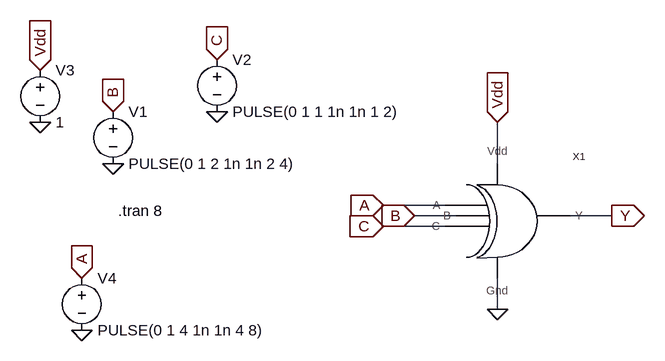
[diagram p0: schematic 3i_xor_test.asc]
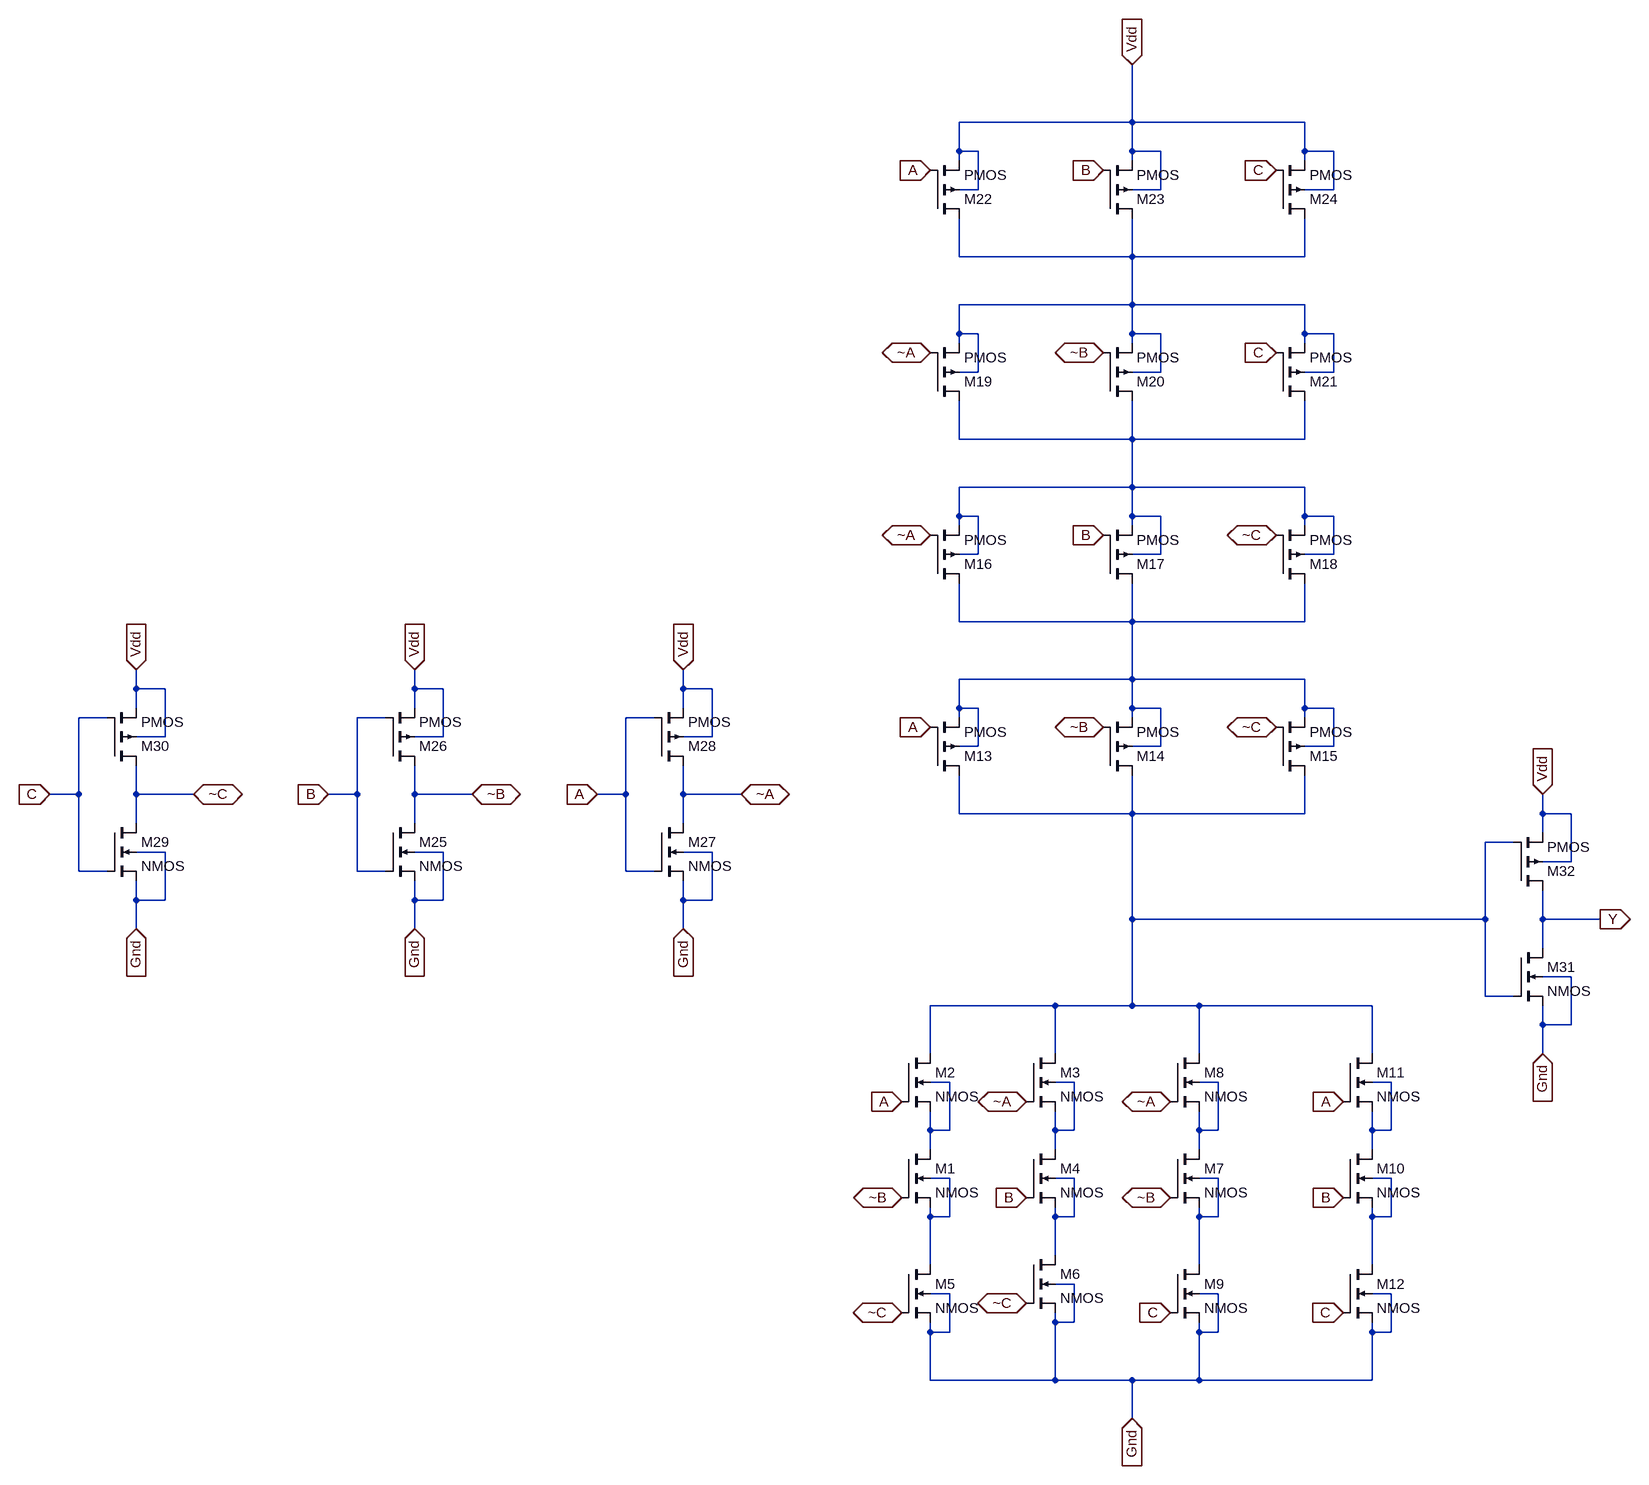
[diagram p1: sub-circuit 3i_xor.asc]
3i_xor_test.asc, the LTspice schematic file:
Version 4
SHEET 1 880 680
WIRE 288 80 288 16
WIRE 208 144 112 144
WIRE 224 160 160 160
WIRE 464 160 400 160
WIRE 208 176 112 176
WIRE 288 304 288 256
FLAG 112 144 A
IOPIN 112 144 In
FLAG 160 160 B
IOPIN 160 160 In
FLAG 112 176 C
IOPIN 112 176 In
FLAG 288 16 Vdd
IOPIN 288 16 In
FLAG 288 304 0
FLAG 464 160 Y
IOPIN 464 160 Out
FLAG -304 0 B
IOPIN -304 0 In
FLAG -144 -80 C
IOPIN -144 -80 In
FLAG -416 -64 Vdd
IOPIN -416 -64 In
FLAG -416 16 0
FLAG -304 80 0
FLAG -144 0 0
FLAG -352 256 A
IOPIN -352 256 In
FLAG -352 336 0
SYMBOL 3i_xor 304 160 R0
SYMATTR InstName X1
SYMBOL voltage -304 -16 R0
WINDOW 123 0 0 Left 0
WINDOW 39 0 0 Left 0
SYMATTR InstName V1
SYMATTR Value PULSE(0 1 2 1n 1n 2 4)
SYMBOL voltage -144 -96 R0
WINDOW 123 0 0 Left 0
WINDOW 39 0 0 Left 0
SYMATTR InstName V2
SYMATTR Value PULSE(0 1 1 1n 1n 1 2)
SYMBOL voltage -416 -80 R0
SYMATTR InstName V3
SYMATTR Value 1
SYMBOL voltage -352 240 R0
WINDOW 123 0 0 Left 0
WINDOW 39 0 0 Left 0
SYMATTR InstName V4
SYMATTR Value PULSE(0 1 4 1n 1n 4 8)
TEXT -296 152 Left 2 !.tran 8

3i_xor.asc, the sub-circuit schematic file:
Version 4
SHEET 1 1516 712
WIRE 448 -1552 448 -1648
WIRE 448 -1552 160 -1552
WIRE 736 -1552 448 -1552
WIRE 160 -1504 160 -1552
WIRE 192 -1504 160 -1504
WIRE 448 -1504 448 -1552
WIRE 496 -1504 448 -1504
WIRE 736 -1504 736 -1552
WIRE 784 -1504 736 -1504
WIRE 160 -1488 160 -1504
WIRE 448 -1488 448 -1504
WIRE 736 -1488 736 -1504
WIRE 192 -1440 192 -1504
WIRE 192 -1440 160 -1440
WIRE 496 -1440 496 -1504
WIRE 496 -1440 448 -1440
WIRE 784 -1440 784 -1504
WIRE 784 -1440 736 -1440
WIRE 160 -1328 160 -1392
WIRE 448 -1328 448 -1392
WIRE 448 -1328 160 -1328
WIRE 736 -1328 736 -1392
WIRE 736 -1328 448 -1328
WIRE 448 -1248 448 -1328
WIRE 448 -1248 160 -1248
WIRE 736 -1248 448 -1248
WIRE 160 -1200 160 -1248
WIRE 192 -1200 160 -1200
WIRE 448 -1200 448 -1248
WIRE 496 -1200 448 -1200
WIRE 736 -1200 736 -1248
WIRE 784 -1200 736 -1200
WIRE 160 -1184 160 -1200
WIRE 448 -1184 448 -1200
WIRE 736 -1184 736 -1200
WIRE 192 -1136 192 -1200
WIRE 192 -1136 160 -1136
WIRE 496 -1136 496 -1200
WIRE 496 -1136 448 -1136
WIRE 784 -1136 784 -1200
WIRE 784 -1136 736 -1136
WIRE 160 -1024 160 -1088
WIRE 448 -1024 448 -1088
WIRE 448 -1024 160 -1024
WIRE 736 -1024 736 -1088
WIRE 736 -1024 448 -1024
WIRE 448 -944 448 -1024
WIRE 448 -944 160 -944
WIRE 736 -944 448 -944
WIRE 160 -896 160 -944
WIRE 192 -896 160 -896
WIRE 448 -896 448 -944
WIRE 496 -896 448 -896
WIRE 736 -896 736 -944
WIRE 784 -896 736 -896
WIRE 160 -880 160 -896
WIRE 448 -880 448 -896
WIRE 736 -880 736 -896
WIRE 192 -832 192 -896
WIRE 192 -832 160 -832
WIRE 496 -832 496 -896
WIRE 496 -832 448 -832
WIRE 784 -832 784 -896
WIRE 784 -832 736 -832
WIRE 160 -720 160 -784
WIRE 448 -720 448 -784
WIRE 448 -720 160 -720
WIRE 736 -720 736 -784
WIRE 736 -720 448 -720
WIRE 448 -624 448 -720
WIRE 448 -624 160 -624
WIRE 736 -624 448 -624
WIRE -1760 -608 -1760 -640
WIRE -1712 -608 -1760 -608
WIRE -1296 -608 -1296 -640
WIRE -1248 -608 -1296 -608
WIRE -848 -608 -848 -640
WIRE -800 -608 -848 -608
WIRE -1760 -576 -1760 -608
WIRE -1296 -576 -1296 -608
WIRE -848 -576 -848 -608
WIRE 160 -576 160 -624
WIRE 192 -576 160 -576
WIRE 448 -576 448 -624
WIRE 496 -576 448 -576
WIRE 736 -576 736 -624
WIRE 784 -576 736 -576
WIRE -1808 -560 -1856 -560
WIRE -1344 -560 -1392 -560
WIRE -896 -560 -944 -560
WIRE 160 -560 160 -576
WIRE 448 -560 448 -576
WIRE 736 -560 736 -576
WIRE -1712 -528 -1712 -608
WIRE -1712 -528 -1760 -528
WIRE -1248 -528 -1248 -608
WIRE -1248 -528 -1296 -528
WIRE -800 -528 -800 -608
WIRE -800 -528 -848 -528
WIRE 192 -512 192 -576
WIRE 192 -512 160 -512
WIRE 496 -512 496 -576
WIRE 496 -512 448 -512
WIRE 784 -512 784 -576
WIRE 784 -512 736 -512
WIRE -1856 -432 -1856 -560
WIRE -1856 -432 -1904 -432
WIRE -1760 -432 -1760 -480
WIRE -1664 -432 -1760 -432
WIRE -1392 -432 -1392 -560
WIRE -1392 -432 -1440 -432
WIRE -1296 -432 -1296 -480
WIRE -1200 -432 -1296 -432
WIRE -944 -432 -944 -560
WIRE -944 -432 -992 -432
WIRE -848 -432 -848 -480
WIRE -752 -432 -848 -432
WIRE 160 -400 160 -464
WIRE 448 -400 448 -464
WIRE 448 -400 160 -400
WIRE 736 -400 736 -464
WIRE 736 -400 448 -400
WIRE 1184 -400 1184 -432
WIRE 1232 -400 1184 -400
WIRE -1760 -384 -1760 -432
WIRE -1296 -384 -1296 -432
WIRE -848 -384 -848 -432
WIRE 1184 -368 1184 -400
WIRE 1136 -352 1088 -352
WIRE -1712 -336 -1760 -336
WIRE -1248 -336 -1296 -336
WIRE -800 -336 -848 -336
WIRE 1232 -320 1232 -400
WIRE 1232 -320 1184 -320
WIRE -1856 -304 -1856 -432
WIRE -1808 -304 -1856 -304
WIRE -1392 -304 -1392 -432
WIRE -1344 -304 -1392 -304
WIRE -944 -304 -944 -432
WIRE -896 -304 -944 -304
WIRE -1760 -256 -1760 -288
WIRE -1712 -256 -1712 -336
WIRE -1712 -256 -1760 -256
WIRE -1296 -256 -1296 -288
WIRE -1248 -256 -1248 -336
WIRE -1248 -256 -1296 -256
WIRE -848 -256 -848 -288
WIRE -800 -256 -800 -336
WIRE -800 -256 -848 -256
WIRE 448 -224 448 -400
WIRE 1088 -224 1088 -352
WIRE 1088 -224 448 -224
WIRE 1184 -224 1184 -272
WIRE 1280 -224 1184 -224
WIRE -1760 -208 -1760 -256
WIRE -1296 -208 -1296 -256
WIRE -848 -208 -848 -256
WIRE 1184 -176 1184 -224
WIRE 1232 -128 1184 -128
WIRE 1088 -96 1088 -224
WIRE 1136 -96 1088 -96
WIRE 320 -80 112 -80
WIRE 448 -80 448 -224
WIRE 448 -80 320 -80
WIRE 560 -80 448 -80
WIRE 848 -80 560 -80
WIRE 1184 -48 1184 -80
WIRE 1232 -48 1232 -128
WIRE 1232 -48 1184 -48
WIRE 112 0 112 -80
WIRE 320 0 320 -80
WIRE 560 0 560 -80
WIRE 848 0 848 -80
WIRE 1184 0 1184 -48
WIRE 144 48 112 48
WIRE 352 48 320 48
WIRE 592 48 560 48
WIRE 880 48 848 48
WIRE 112 128 112 96
WIRE 144 128 144 48
WIRE 144 128 112 128
WIRE 320 128 320 96
WIRE 352 128 352 48
WIRE 352 128 320 128
WIRE 560 128 560 96
WIRE 592 128 592 48
WIRE 592 128 560 128
WIRE 848 128 848 96
WIRE 880 128 880 48
WIRE 880 128 848 128
WIRE 112 160 112 128
WIRE 320 160 320 128
WIRE 560 160 560 128
WIRE 848 160 848 128
WIRE 144 208 112 208
WIRE 352 208 320 208
WIRE 592 208 560 208
WIRE 880 208 848 208
WIRE 112 272 112 256
WIRE 144 272 144 208
WIRE 144 272 112 272
WIRE 320 272 320 256
WIRE 352 272 352 208
WIRE 352 272 320 272
WIRE 560 272 560 256
WIRE 592 272 592 208
WIRE 592 272 560 272
WIRE 848 272 848 256
WIRE 880 272 880 208
WIRE 880 272 848 272
WIRE 320 336 320 272
WIRE 112 352 112 272
WIRE 560 352 560 272
WIRE 848 352 848 272
WIRE 352 384 320 384
WIRE 144 400 112 400
WIRE 592 400 560 400
WIRE 880 400 848 400
WIRE 320 448 320 432
WIRE 352 448 352 384
WIRE 352 448 320 448
WIRE 112 464 112 448
WIRE 144 464 144 400
WIRE 144 464 112 464
WIRE 560 464 560 448
WIRE 592 464 592 400
WIRE 592 464 560 464
WIRE 848 464 848 448
WIRE 880 464 880 400
WIRE 880 464 848 464
WIRE 112 544 112 464
WIRE 320 544 320 448
WIRE 320 544 112 544
WIRE 448 544 320 544
WIRE 560 544 560 464
WIRE 560 544 448 544
WIRE 848 544 848 464
WIRE 848 544 560 544
WIRE 448 608 448 544
FLAG 64 80 A
IOPIN 64 80 In
FLAG 64 240 ~B
IOPIN 64 240 BiDir
FLAG 272 80 ~A
IOPIN 272 80 BiDir
FLAG 272 240 B
IOPIN 272 240 In
FLAG 64 432 ~C
IOPIN 64 432 BiDir
FLAG 272 416 ~C
IOPIN 272 416 BiDir
FLAG 512 80 ~A
IOPIN 512 80 BiDir
FLAG 512 240 ~B
IOPIN 512 240 BiDir
FLAG 512 432 C
IOPIN 512 432 In
FLAG 800 80 A
IOPIN 800 80 In
FLAG 800 240 B
IOPIN 800 240 In
FLAG 800 432 C
IOPIN 800 432 In
FLAG 112 -544 A
IOPIN 112 -544 In
FLAG 400 -544 ~B
IOPIN 400 -544 BiDir
FLAG 688 -544 ~C
IOPIN 688 -544 BiDir
FLAG 112 -864 ~A
IOPIN 112 -864 BiDir
FLAG 400 -864 B
IOPIN 400 -864 In
FLAG 688 -864 ~C
IOPIN 688 -864 BiDir
FLAG 112 -1168 ~A
IOPIN 112 -1168 BiDir
FLAG 400 -1168 ~B
IOPIN 400 -1168 BiDir
FLAG 688 -1168 C
IOPIN 688 -1168 In
FLAG 112 -1472 A
IOPIN 112 -1472 In
FLAG 400 -1472 B
IOPIN 400 -1472 In
FLAG 688 -1472 C
IOPIN 688 -1472 In
FLAG 448 -1648 Vdd
IOPIN 448 -1648 In
FLAG 448 608 Gnd
IOPIN 448 608 In
FLAG -1296 -640 Vdd
IOPIN -1296 -640 In
FLAG -1440 -432 B
IOPIN -1440 -432 In
FLAG -1200 -432 ~B
IOPIN -1200 -432 BiDir
FLAG -848 -640 Vdd
IOPIN -848 -640 In
FLAG -992 -432 A
IOPIN -992 -432 In
FLAG -752 -432 ~A
IOPIN -752 -432 BiDir
FLAG -1296 -208 Gnd
IOPIN -1296 -208 In
FLAG -848 -208 Gnd
IOPIN -848 -208 In
FLAG -1760 -640 Vdd
IOPIN -1760 -640 In
FLAG -1904 -432 C
IOPIN -1904 -432 In
FLAG -1664 -432 ~C
IOPIN -1664 -432 BiDir
FLAG -1760 -208 Gnd
IOPIN -1760 -208 In
FLAG 1184 -432 Vdd
IOPIN 1184 -432 In
FLAG 1280 -224 Y
IOPIN 1280 -224 Out
FLAG 1184 0 Gnd
IOPIN 1184 0 In
SYMBOL nmos4 64 160 R0
SYMATTR InstName M1
SYMBOL nmos4 64 0 R0
SYMATTR InstName M2
SYMBOL nmos4 272 0 R0
SYMATTR InstName M3
SYMBOL nmos4 272 160 R0
SYMATTR InstName M4
SYMBOL nmos4 64 352 R0
SYMATTR InstName M5
SYMBOL nmos4 272 336 R0
SYMATTR InstName M6
SYMBOL nmos4 512 160 R0
SYMATTR InstName M7
SYMBOL nmos4 512 0 R0
SYMATTR InstName M8
SYMBOL nmos4 512 352 R0
SYMATTR InstName M9
SYMBOL nmos4 800 160 R0
SYMATTR InstName M10
SYMBOL nmos4 800 0 R0
SYMATTR InstName M11
SYMBOL nmos4 800 352 R0
SYMATTR InstName M12
SYMBOL pmos4 112 -464 M180
SYMATTR InstName M13
SYMBOL pmos4 400 -464 M180
SYMATTR InstName M14
SYMBOL pmos4 688 -464 M180
SYMATTR InstName M15
SYMBOL pmos4 112 -784 M180
SYMATTR InstName M16
SYMBOL pmos4 400 -784 M180
SYMATTR InstName M17
SYMBOL pmos4 688 -784 M180
SYMATTR InstName M18
SYMBOL pmos4 112 -1088 M180
SYMATTR InstName M19
SYMBOL pmos4 400 -1088 M180
SYMATTR InstName M20
SYMBOL pmos4 688 -1088 M180
SYMATTR InstName M21
SYMBOL pmos4 112 -1392 M180
SYMATTR InstName M22
SYMBOL pmos4 400 -1392 M180
SYMATTR InstName M23
SYMBOL pmos4 688 -1392 M180
SYMATTR InstName M24
SYMBOL nmos4 -1344 -384 R0
SYMATTR InstName M25
SYMBOL pmos4 -1344 -480 M180
SYMATTR InstName M26
SYMBOL nmos4 -896 -384 R0
SYMATTR InstName M27
SYMBOL pmos4 -896 -480 M180
SYMATTR InstName M28
SYMBOL nmos4 -1808 -384 R0
SYMATTR InstName M29
SYMBOL pmos4 -1808 -480 M180
SYMATTR InstName M30
SYMBOL nmos4 1136 -176 R0
SYMATTR InstName M31
SYMBOL pmos4 1136 -272 M180
SYMATTR InstName M32

The netlist it stands for:
* 3i_xor_test.asc
XX1 A B C Vdd 0 Y 3i_xor
V1 B 0 PULSE(0 1 2 1n 1n 2 4)
V2 C 0 PULSE(0 1 1 1n 1n 1 2)
V3 Vdd 0 1
V4 A 0 PULSE(0 1 4 1n 1n 4 8)

* block symbol definitions
.subckt 3i_xor A B C Vdd Gnd Y
M1 N005 ~B N009 N009 NMOS
M2 N004 A N005 N005 NMOS
M3 N004 ~A N006 N006 NMOS
M4 N006 B N010 N010 NMOS
M5 N009 ~C Gnd Gnd NMOS
M6 N010 ~C Gnd Gnd NMOS
M7 N007 ~B N011 N011 NMOS
M8 N004 ~A N007 N007 NMOS
M9 N011 C Gnd Gnd NMOS
M10 N008 B N012 N012 NMOS
M11 N004 A N008 N008 NMOS
M12 N012 C Gnd Gnd NMOS
M13 N004 A N003 N003 PMOS
M14 N004 ~B N003 N003 PMOS
M15 N004 ~C N003 N003 PMOS
M16 N003 ~A N002 N002 PMOS
M17 N003 B N002 N002 PMOS
M18 N003 ~C N002 N002 PMOS
M19 N002 ~A N001 N001 PMOS
M20 N002 ~B N001 N001 PMOS
M21 N002 C N001 N001 PMOS
M22 N001 A Vdd Vdd PMOS
M23 N001 B Vdd Vdd PMOS
M24 N001 C Vdd Vdd PMOS
M25 ~B B Gnd Gnd NMOS
M26 ~B B Vdd Vdd PMOS
M27 ~A A Gnd Gnd NMOS
M28 ~A A Vdd Vdd PMOS
M29 ~C C Gnd Gnd NMOS
M30 ~C C Vdd Vdd PMOS
M31 Y N004 Gnd Gnd NMOS
M32 Y N004 Vdd Vdd PMOS
.ends 3i_xor

.model NMOS NMOS
.model PMOS PMOS
.lib standard.mos
.tran 8
.backanno
.end

* Results of the author's LTspice run, read from the files saved beside the schematic
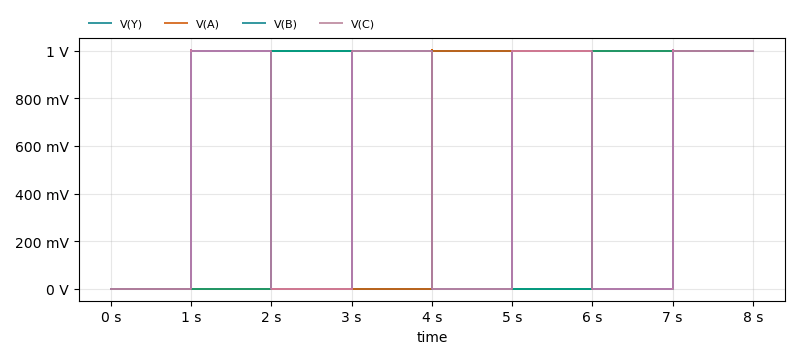
[diagram p2: Transient Analysis of 3i_xor_test.asc, plotted from the saved traces]
* Transient Analysis, 1 run:
*   V(Y): min 100.5 nV, max 1 V, average 500 mV, rms 707.1 mV, last 1 V
*   V(A): min 0 V, max 1 V, average 500 mV, rms 707.1 mV, last 1 V
*   V(B): min 0 V, max 1 V, average 500 mV, rms 707.1 mV, last 1 V
*   V(C): min 0 V, max 1.001 V, average 500 mV, rms 707.1 mV, last 1 V